# EAGLE design MaxBotix-Helper (EAGLE 9.2.0)
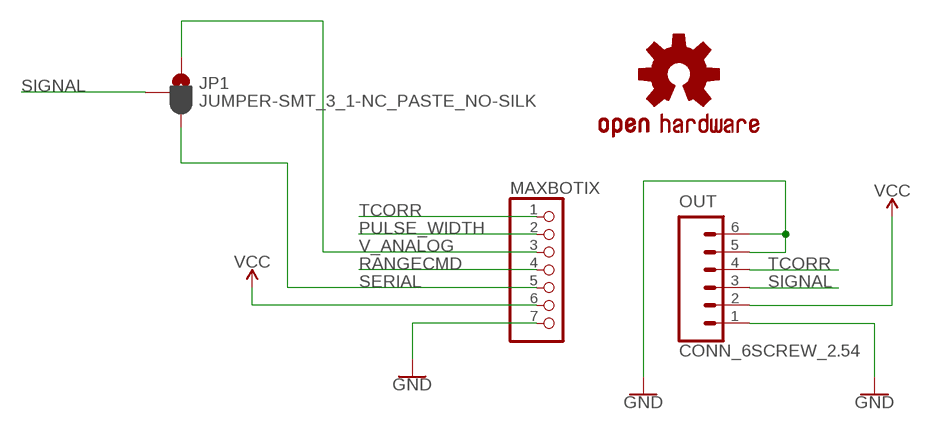
[diagram p0: schematic, sheet 1]

## Parts
JP1  JUMPER-SMT_3_1-NC_PASTE_NO-SILK  [SMT-JUMPER_3_1-NC_PASTE_NO-SILK]
LOGO1  OSHW-LOGOS  [OSHW-LOGO-S]
MAXBOTIX  CONN_7  [1X07]
OUT  CONN_6SCREW_2.54  [1X06_SCREW]

## Nets
GND: MAXBOTIX.7 OUT.1 OUT.5 OUT.6
PULSE_WIDTH: MAXBOTIX.2
RANGECMD: MAXBOTIX.4
SERIAL: JP1.3 MAXBOTIX.5
SIGNAL: JP1.2 OUT.3
TCORR: MAXBOTIX.1 OUT.4
V_ANALOG: JP1.1 MAXBOTIX.3
VCC: MAXBOTIX.6 OUT.2

## Library data of the parts
JP1 = SparkFun-Jumpers:JUMPER-SMT_3_1-NC_PASTE: Normally closed solder jumper (1 of 2 connections) This jumper has an aperture in the stencil to allow solder paste to bridge one of the two connections. One connection is normally closed (NC), while the other is normally open (NO). Wick off the solder to open the connection. Reapply solder to reclose the connection. Apply solder to the other side instead to change the current path.
LOGO1 = bschulz:OSHW-LOGO: Open-Source Hardware (OSHW) Logo This logo indicates the piece of hardware it is found on incorporates a OSHW license and/or adheres to the definition of open source hardware found here: http://freedomdefined.org/OSHW
MAXBOTIX = bschulz:CONN_7: Genaric 7 terminal header
OUT = bschulz:CONN_6: Genaric 6 terminal header Digikey 2.54_SCREW <https://www.digikey.com/product-detail/en/on-shore-technology-inc/OSTVN06A150/ED10565-ND/1588866>; DIGIKEY: ED10565-ND; MF: OnShore; MPN: OSTVN06A150

## Board
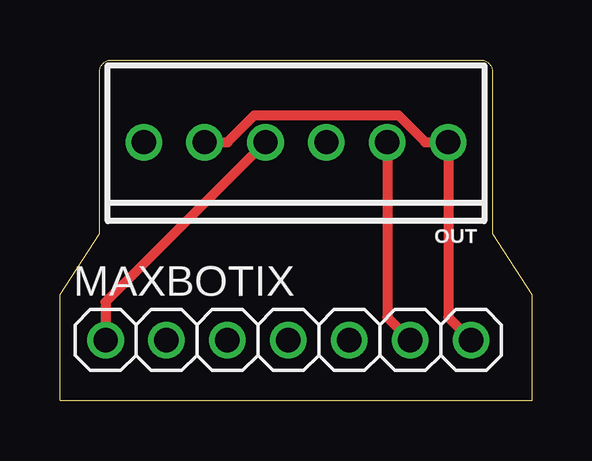
[diagram p1: board, top side]
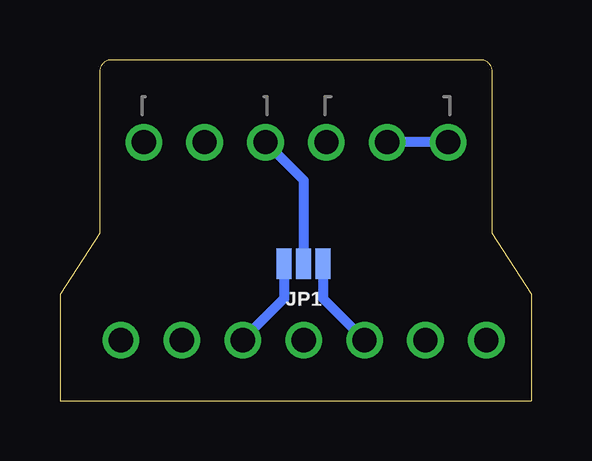
[diagram p2: board, bottom side, seen from below]

Size 19.68 x 14.22 mm. Coordinates in mm from the lower left corner, seen from the top.
Outline: 19.68,0 0.03,0 0.01,0.02 0,0.04 0,4.43 0,4.44 0,4.45 1.65,6.98 1.65,6.99 1.65,13.72 arc-90 2.15,14.22 17.53,14.22 arc-90 18.03,13.72 18.03,6.99 19.68,4.45 19.68,0
Copper layers (1*16): Top 0.035mm / dielectric 1.5mm / Bottom 0.035mm
Design rules "default": minimum track width 6mil, minimum drill 0.35mm, track to track 6mil, track to pad 6mil, pad to pad 6mil, via to via 6mil, smd to smd 6mil, copper to edge 40mil, drill to drill 6mil, minimum pad ring 10mil, minimum via ring 8mil, stop-mask expansion 4mil, vias tented up to drill 0mil, thermal gap 10mil

### Footprints (pad centres in the part's own frame; a part is rotated, then mirrored left to right if it is on the bottom)
SMT-JUMPER_3_1-NC_PASTE_NO-SILK = smd 0.635 x 1.27: 1 -0.813,0; 2 0,0; 3 0.813,0
1X07 = drill 1.016: 1 -7.62,0; 2 -5.08,0; 3 -2.54,0; 4 0,0; 5 2.54,0; 6 5.08,0; 7 7.62,0
1X06_SCREW = drill 1.016: 1 -6.35,0; 2 -3.81,0; 3 -1.27,0; 4 1.27,0; 5 3.81,0; 6 6.35,0

### Placement (x,y rotation side)
JP1  9.53,5.71 180 bottom
LOGO1  15.37,4.95 0 bottom
MAXBOTIX  9.53,2.54 0 top
OUT  9.84,10.79 180 top

### Tracks (layer width: path | path; a pad name or v marks a point on that pad's centre or on a via)
GND
  Top 0.406: MAXBOTIX.7 16.19,3.49 OUT.1 15.23,10.79 14.12,11.91 8.11,11.91 6.99,10.79 OUT.5
  Bottom 0.406: OUT.6 OUT.5
SERIAL
  Bottom 0.406: JP1.3 10.34,4.27 MAXBOTIX.5
SIGNAL
  Bottom 0.406: OUT.3 9.53,9.21 JP1.2
TCORR
  Top 0.406: OUT.4 1.91,4.13 MAXBOTIX.1
V_ANALOG
  Bottom 0.406: MAXBOTIX.3 8.71,4.27 JP1.1
VCC
  Top 0.406: OUT.2 13.65,3.49 MAXBOTIX.6

### Text on the board
tDocu: GND | GND | TC | SIG | V+ | GND | MaxBotix-Helper v1.0 - A. Wickert - 2019.04.28
bDocu: T corr. | Logger | GND | GND | TC | SIG | V+ | GND | Analog | Serial | signal select | Northern / Widget LLC